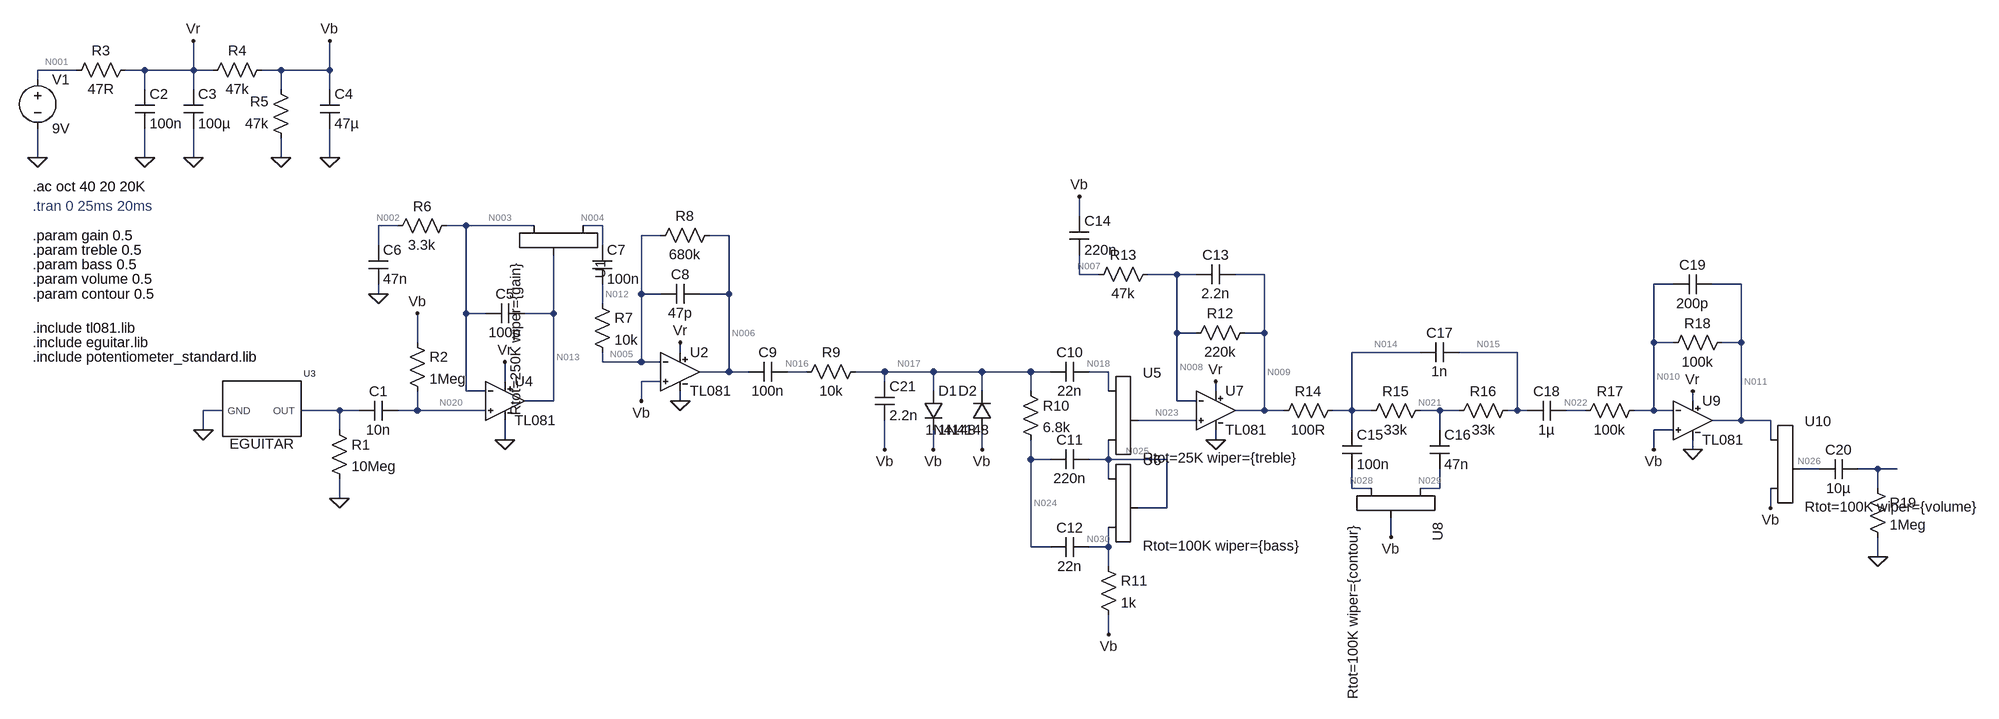
[diagram p0: schematic Shredmaster.asc]
Shredmaster.asc, the LTspice schematic file:
Version 4
SHEET 1 2884 852
WIRE -160 -224 -224 -224
WIRE -48 -224 -80 -224
WIRE 32 -224 32 -272
WIRE 32 -224 -48 -224
WIRE 64 -224 32 -224
WIRE 176 -224 144 -224
WIRE 256 -224 256 -272
WIRE 256 -224 176 -224
WIRE -224 -208 -224 -224
WIRE -48 -192 -48 -224
WIRE 32 -192 32 -224
WIRE 176 -192 176 -224
WIRE 256 -192 256 -224
WIRE -224 -80 -224 -128
WIRE -48 -80 -48 -128
WIRE 32 -80 32 -128
WIRE 176 -80 176 -112
WIRE 256 -80 256 -128
WIRE 1488 16 1488 -16
WIRE 368 32 336 32
WIRE 480 32 448 32
WIRE 592 32 480 32
WIRE 704 32 672 32
WIRE 800 48 768 48
WIRE 912 48 880 48
WIRE 336 64 336 32
WIRE 704 64 704 32
WIRE 1488 112 1488 80
WIRE 1520 112 1488 112
WIRE 1648 112 1600 112
WIRE 1680 112 1648 112
WIRE 1792 112 1744 112
WIRE 2464 128 2432 128
WIRE 2576 128 2528 128
WIRE 336 144 336 128
WIRE 768 144 768 48
WIRE 800 144 768 144
WIRE 912 144 912 48
WIRE 912 144 864 144
WIRE 704 160 704 128
WIRE 480 176 480 32
WIRE 512 176 480 176
WIRE 624 176 624 80
WIRE 624 176 576 176
WIRE 1648 208 1648 112
WIRE 1680 208 1648 208
WIRE 1792 208 1792 112
WIRE 1792 208 1760 208
WIRE 400 224 400 176
WIRE 2432 224 2432 128
WIRE 2464 224 2432 224
WIRE 2576 224 2576 128
WIRE 2576 224 2544 224
WIRE 832 240 832 224
WIRE 2048 240 1936 240
WIRE 2208 240 2112 240
WIRE 704 256 704 240
WIRE 768 256 768 144
WIRE 768 256 704 256
WIRE 800 256 768 256
WIRE 912 272 912 144
WIRE 912 272 864 272
WIRE 944 272 912 272
WIRE 1040 272 1008 272
WIRE 1168 272 1120 272
WIRE 1248 272 1168 272
WIRE 1328 272 1248 272
WIRE 1408 272 1328 272
WIRE 1440 272 1408 272
WIRE 1536 272 1504 272
WIRE 544 288 544 256
WIRE 800 288 768 288
WIRE 1168 288 1168 272
WIRE 480 304 480 176
WIRE 512 304 480 304
WIRE 1248 304 1248 272
WIRE 1328 304 1328 272
WIRE 1408 304 1408 272
WIRE 1536 304 1536 272
WIRE 1712 304 1712 288
WIRE 624 320 624 176
WIRE 624 320 576 320
WIRE 768 320 768 288
WIRE 832 320 832 304
WIRE 1648 320 1648 208
WIRE 1680 320 1648 320
WIRE 2496 320 2496 304
WIRE 80 336 48 336
WIRE 272 336 208 336
WIRE 304 336 272 336
WIRE 400 336 400 304
WIRE 400 336 368 336
WIRE 512 336 400 336
WIRE 1792 336 1792 208
WIRE 1792 336 1744 336
WIRE 1824 336 1792 336
WIRE 1936 336 1936 240
WIRE 1936 336 1904 336
WIRE 1968 336 1936 336
WIRE 2080 336 2048 336
WIRE 2112 336 2080 336
WIRE 2208 336 2208 240
WIRE 2208 336 2192 336
WIRE 2224 336 2208 336
WIRE 2320 336 2288 336
WIRE 2432 336 2432 224
WIRE 2432 336 2400 336
WIRE 2464 336 2432 336
WIRE 1680 352 1584 352
WIRE 2576 352 2576 224
WIRE 2576 352 2528 352
WIRE 2624 352 2576 352
WIRE 48 368 48 336
WIRE 272 368 272 336
WIRE 1936 368 1936 336
WIRE 2080 368 2080 336
WIRE 2464 368 2432 368
WIRE 544 384 544 352
WIRE 1712 384 1712 368
WIRE 2624 384 2624 352
WIRE 1168 400 1168 352
WIRE 1248 400 1248 368
WIRE 1328 400 1328 368
WIRE 2432 400 2432 368
WIRE 2496 400 2496 384
WIRE 1408 416 1408 384
WIRE 1440 416 1408 416
WIRE 1536 416 1536 384
WIRE 1536 416 1504 416
WIRE 1632 416 1536 416
WIRE 2704 432 2672 432
WIRE 2800 432 2768 432
WIRE 2832 432 2800 432
WIRE 1536 448 1536 416
WIRE 1936 464 1936 432
WIRE 1968 464 1936 464
WIRE 2080 464 2080 432
WIRE 2080 464 2048 464
WIRE 2800 464 2800 432
WIRE 272 480 272 448
WIRE 1632 496 1632 416
WIRE 1632 496 1584 496
WIRE 2624 496 2624 464
WIRE 2000 544 2000 512
WIRE 1408 560 1408 416
WIRE 1440 560 1408 560
WIRE 1536 560 1536 528
WIRE 1536 560 1504 560
WIRE 2800 576 2800 544
WIRE 1536 592 1536 560
WIRE 1536 704 1536 672
FLAG 176 -80 0
FLAG 256 -80 0
FLAG 32 -80 0
FLAG -48 -80 0
FLAG 32 -272 Vr
FLAG 256 -272 Vb
FLAG 48 368 0
FLAG -224 -80 0
FLAG 272 480 0
FLAG 400 176 Vb
FLAG 544 384 0
FLAG 544 256 Vr
FLAG 832 320 0
FLAG 832 224 Vr
FLAG 768 320 Vb
FLAG 1536 704 Vb
FLAG 1712 288 Vr
FLAG 1712 384 0
FLAG 1488 -16 Vb
FLAG 2000 544 Vb
FLAG 2432 400 Vb
FLAG 2496 304 Vr
FLAG 2496 400 0
FLAG 2624 496 Vb
FLAG 2800 576 0
FLAG 336 144 0
FLAG 1168 400 Vb
FLAG 1248 400 Vb
FLAG 1328 400 Vb
SYMBOL res -64 -240 R90
WINDOW 0 0 56 VBottom 2
WINDOW 3 32 56 VTop 2
SYMATTR InstName R3
SYMATTR Value 47R
SYMBOL cap -64 -192 R0
SYMATTR InstName C2
SYMATTR Value 100n
SYMBOL cap 16 -192 R0
SYMATTR InstName C3
SYMATTR Value 100µ
SYMBOL res 160 -240 R90
WINDOW 0 0 56 VBottom 2
WINDOW 3 32 56 VTop 2
SYMATTR InstName R4
SYMATTR Value 47k
SYMBOL res 192 -96 R180
WINDOW 0 36 76 Left 2
WINDOW 3 36 40 Left 2
SYMATTR InstName R5
SYMATTR Value 47k
SYMBOL cap 240 -192 R0
SYMATTR InstName C4
SYMATTR Value 47µ
SYMBOL eguitar 176 352 R0
SYMATTR InstName U3
SYMBOL voltage -224 -224 R0
WINDOW 123 0 0 Left 0
WINDOW 39 0 0 Left 0
SYMATTR InstName V1
SYMATTR Value 9V
SYMBOL res 256 352 R0
SYMATTR InstName R1
SYMATTR Value 10Meg
SYMBOL cap 368 320 R90
WINDOW 0 0 32 VBottom 2
WINDOW 3 32 32 VTop 2
SYMATTR InstName C1
SYMATTR Value 10n
SYMBOL res 384 208 R0
SYMATTR InstName R2
SYMATTR Value 1Meg
SYMBOL TL081 544 256 R0
SYMATTR InstName U4
SYMATTR Value TL081
SYMBOL cap 576 160 R90
WINDOW 0 0 32 VBottom 2
WINDOW 3 32 32 VTop 2
SYMATTR InstName C5
SYMATTR Value 100p
SYMBOL potentiometer_standard 688 16 R90
SYMATTR InstName U1
SYMATTR Value Rtot=250K wiper={gain}
SYMATTR SpiceLine ""
SYMBOL cap 688 64 R0
SYMATTR InstName C7
SYMATTR Value 100n
SYMBOL res 688 144 R0
SYMATTR InstName R7
SYMATTR Value 10k
SYMBOL TL081 832 208 R0
SYMATTR InstName U2
SYMATTR Value TL081
SYMBOL cap 864 128 R90
WINDOW 0 0 32 VBottom 2
WINDOW 3 32 32 VTop 2
SYMATTR InstName C8
SYMATTR Value 47p
SYMBOL res 896 32 R90
WINDOW 0 0 56 VBottom 2
WINDOW 3 32 56 VTop 2
SYMATTR InstName R8
SYMATTR Value 680k
SYMBOL cap 1008 256 R90
WINDOW 0 0 32 VBottom 2
WINDOW 3 32 32 VTop 2
SYMATTR InstName C9
SYMATTR Value 100n
SYMBOL res 1136 256 R90
WINDOW 0 0 56 VBottom 2
WINDOW 3 32 56 VTop 2
SYMATTR InstName R9
SYMATTR Value 10k
SYMBOL cap 1504 256 R90
WINDOW 0 0 32 VBottom 2
WINDOW 3 32 32 VTop 2
SYMATTR InstName C10
SYMATTR Value 22n
SYMBOL res 1392 288 R0
SYMATTR InstName R10
SYMATTR Value 6.8k
SYMBOL potentiometer_standard 1520 288 R0
SYMATTR InstName U5
SYMATTR Value Rtot=25K wiper={treble}
SYMATTR SpiceLine ""
SYMBOL potentiometer_standard 1520 432 R0
SYMATTR InstName U6
SYMATTR Value Rtot=100K wiper={bass}
SYMATTR SpiceLine ""
SYMBOL cap 1504 400 R90
WINDOW 0 0 32 VBottom 2
WINDOW 3 32 32 VTop 2
SYMATTR InstName C11
SYMATTR Value 220n
SYMBOL cap 1504 544 R90
WINDOW 0 0 32 VBottom 2
WINDOW 3 32 32 VTop 2
SYMATTR InstName C12
SYMATTR Value 22n
SYMBOL res 1520 576 R0
SYMATTR InstName R11
SYMATTR Value 1k
SYMBOL TL081 1712 272 R0
SYMATTR InstName U7
SYMATTR Value TL081
SYMBOL res 1776 192 R90
WINDOW 0 0 56 VBottom 2
WINDOW 3 32 56 VTop 2
SYMATTR InstName R12
SYMATTR Value 220k
SYMBOL cap 1744 96 R90
WINDOW 0 0 32 VBottom 2
WINDOW 3 32 32 VTop 2
SYMATTR InstName C13
SYMATTR Value 2.2n
SYMBOL res 1616 96 R90
WINDOW 0 0 56 VBottom 2
WINDOW 3 32 56 VTop 2
SYMATTR InstName R13
SYMATTR Value 47k
SYMBOL cap 1472 16 R0
SYMATTR InstName C14
SYMATTR Value 220n
SYMBOL res 1920 320 R90
WINDOW 0 0 56 VBottom 2
WINDOW 3 32 56 VTop 2
SYMATTR InstName R14
SYMATTR Value 100R
SYMBOL cap 1920 368 R0
SYMATTR InstName C15
SYMATTR Value 100n
SYMBOL res 2064 320 R90
WINDOW 0 0 56 VBottom 2
WINDOW 3 32 56 VTop 2
SYMATTR InstName R15
SYMATTR Value 33k
SYMBOL cap 2064 368 R0
SYMATTR InstName C16
SYMATTR Value 47n
SYMBOL res 2208 320 R90
WINDOW 0 0 56 VBottom 2
WINDOW 3 32 56 VTop 2
SYMATTR InstName R16
SYMATTR Value 33k
SYMBOL potentiometer_standard 2064 448 R90
SYMATTR InstName U8
SYMATTR Value Rtot=100K wiper={contour}
SYMATTR SpiceLine ""
SYMBOL cap 2112 224 R90
WINDOW 0 0 32 VBottom 2
WINDOW 3 32 32 VTop 2
SYMATTR InstName C17
SYMATTR Value 1n
SYMBOL cap 2288 320 R90
WINDOW 0 0 32 VBottom 2
WINDOW 3 32 32 VTop 2
SYMATTR InstName C18
SYMATTR Value 1µ
SYMBOL res 2416 320 R90
WINDOW 0 0 56 VBottom 2
WINDOW 3 32 56 VTop 2
SYMATTR InstName R17
SYMATTR Value 100k
SYMBOL TL081 2496 288 R0
SYMATTR InstName U9
SYMATTR Value TL081
SYMBOL res 2560 208 R90
WINDOW 0 0 56 VBottom 2
WINDOW 3 32 56 VTop 2
SYMATTR InstName R18
SYMATTR Value 100k
SYMBOL cap 2528 112 R90
WINDOW 0 0 32 VBottom 2
WINDOW 3 32 32 VTop 2
SYMATTR InstName C19
SYMATTR Value 200p
SYMBOL potentiometer_standard 2608 368 R0
SYMATTR InstName U10
SYMATTR Value Rtot=100K wiper={volume}
SYMATTR SpiceLine ""
SYMBOL cap 2768 416 R90
WINDOW 0 0 32 VBottom 2
WINDOW 3 32 32 VTop 2
SYMATTR InstName C20
SYMATTR Value 10µ
SYMBOL res 2784 448 R0
SYMATTR InstName R19
SYMATTR Value 1Meg
SYMBOL res 464 16 R90
WINDOW 0 0 56 VBottom 2
WINDOW 3 32 56 VTop 2
SYMATTR InstName R6
SYMATTR Value 3.3k
SYMBOL cap 320 64 R0
SYMATTR InstName C6
SYMATTR Value 47n
SYMBOL cap 1152 288 R0
SYMATTR InstName C21
SYMATTR Value 2.2n
SYMBOL diode 1232 304 R0
SYMATTR InstName D1
SYMATTR Value 1N4148
SYMBOL diode 1344 368 R180
WINDOW 0 24 64 Left 2
WINDOW 3 24 0 Left 2
SYMATTR InstName D2
SYMATTR Value 1N4148
TEXT -232 -32 Left 2 !.ac oct 40 20 20K
TEXT -232 0 Left 2 ;.tran 0 25ms 20ms
TEXT -232 224 Left 2 !.include eguitar.lib
TEXT -232 248 Left 2 !.include potentiometer_standard.lib
TEXT -232 200 Left 2 !.include tl081.lib
TEXT -232 48 Left 2 !.param gain 0.5
TEXT -232 72 Left 2 !.param treble 0.5
TEXT -232 96 Left 2 !.param bass 0.5
TEXT -232 120 Left 2 !.param volume 0.5
TEXT -232 144 Left 2 !.param contour 0.5

The netlist it stands for:
* Shredmaster.asc
R3 Vr N001 47R
C2 Vr 0 100n
C3 Vr 0 100µ
R4 Vb Vr 47k
R5 0 Vb 47k
C4 Vb 0 47µ
XU3 N019 0 EGUITAR  ; pins OUT GND
V1 N001 0 9V
R1 N019 0 10Meg
C1 N020 N019 10n
R2 Vb N020 1Meg
XU4 N020 N003 Vr 0 N013 TL081 TL081  ; pins In+ In- V+ V- OUT
C5 N013 N003 100p
XU1 N004 N003 N013 Rtot=250K wiper={gain}
C7 N004 N012 100n
R7 N012 N005 10k
XU2 Vb N005 Vr 0 N006 TL081 TL081  ; pins In+ In- V+ V- OUT
C8 N006 N005 47p
R8 N006 N005 680k
C9 N016 N006 100n
R9 N017 N016 10k
C10 N018 N017 22n
R10 N017 N024 6.8k
XU5 N018 N025 N023 Rtot=25K wiper={treble}
XU6 N025 N030 N025 Rtot=100K wiper={bass}
C11 N025 N024 220n
C12 N030 N024 22n
R11 N030 Vb 1k
XU7 N023 N008 Vr 0 N009 TL081 TL081  ; pins In+ In- V+ V- OUT
R12 N009 N008 220k
C13 N009 N008 2.2n
R13 N008 N007 47k
C14 Vb N007 220n
R14 N014 N009 100R
C15 N014 N028 100n
R15 N021 N014 33k
C16 N021 N029 47n
R16 N015 N021 33k
XU8 N029 N028 Vb Rtot=100K wiper={contour}
C17 N015 N014 1n
C18 N022 N015 1µ
R17 N010 N022 100k
XU9 Vb N010 Vr 0 N011 TL081 TL081  ; pins In+ In- V+ V- OUT
R18 N011 N010 100k
C19 N011 N010 200p
XU10 N011 Vb N026 Rtot=100K wiper={volume}
C20 N027 N026 10µ
R19 N027 0 1Meg
R6 N003 N002 3.3k
C6 N002 0 47n
C21 N017 Vb 2.2n
D1 N017 Vb 1N4148
D2 Vb N017 1N4148
.model D D
.lib standard.dio
.ac oct 40 20 20K
* .tran 0 25ms 20ms
.include eguitar.lib
.include potentiometer_standard.lib
.include tl081.lib
.param gain 0.5
.param treble 0.5
.param bass 0.5
.param volume 0.5
.param contour 0.5
.lib eguitar.lib
.lib TL081.lib
.backanno
.end

* Results of the author's LTspice run, read from the files saved beside the schematic
* Operating Point, zero values left out:
*   V(vr) = 8.237 V
*   V(n001) = 9 V
*   V(vb) = 4.118 V
*   V(n020) = 4.118 V
*   V(n013) = 4.118 V
*   V(n003) = 4.118 V
*   V(n004) = 4.118 V
*   V(n012) = 4.118 V
*   V(n005) = 4.118 V
*   V(n006) = 4.118 V
*   V(n016) = 4.118 V
*   V(n017) = 4.118 V
*   V(n018) = 4.118 V
*   V(n024) = 4.118 V
*   V(n023) = 4.118 V
*   V(n025) = 4.118 V
*   V(n030) = 4.118 V
*   V(n009) = 4.118 V
*   V(n008) = 4.118 V
*   V(n007) = 4.118 V
*   V(n014) = 4.118 V
*   V(n028) = 4.118 V
*   V(n021) = 4.118 V
*   V(n029) = 4.118 V
*   V(n015) = 4.118 V
*   V(n022) = 4.118 V
*   V(n010) = 4.118 V
*   V(n011) = 4.118 V
*   V(n026) = 4.118 V
*   V(n002) = 4.118 V
*   I(R18) = 34.17 pA
*   I(R12) = 34.17 pA
*   I(R11) = -34.17 pA
*   I(R8) = 34.17 pA
*   I(R2) = 34.17 pA
*   I(R5) = -87.62 µA
*   I(R4) = -87.62 µA
*   I(R3) = -16.24 mA
*   I(V1) = -16.24 mA
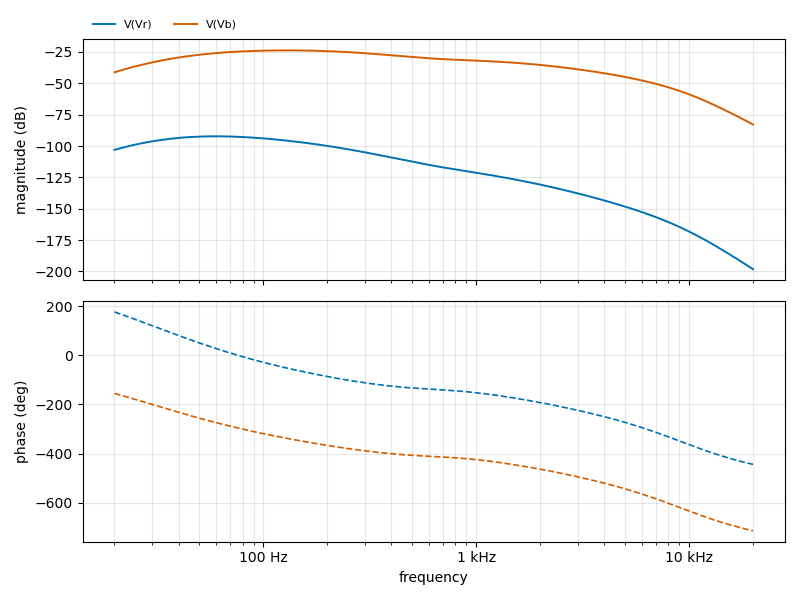
[diagram p1: AC Analysis of Shredmaster.asc, plotted from the saved traces]
* AC Analysis, 1 run:
*   V(Vr): -103.06 dB at 20 Hz, -198.25 dB at 20 kHz, peak -92.26 dB at 59.59 Hz, 3 dB below the peak at 32.8 Hz and 122.2 Hz
*   V(Vb): -41.20 dB at 20 Hz, -82.84 dB at 20 kHz, peak -23.72 dB at 130 Hz, 3 dB below the peak at 53.13 Hz and 343.8 Hz